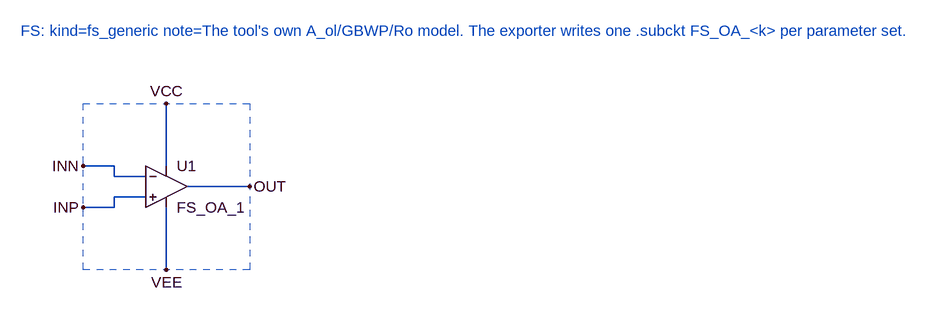
[diagram p0: schematic _FS_generic.asc]
_FS_generic.asc, the LTspice schematic file:
Version 4
SHEET 1 560 560
WIRE 224 240 176 240
WIRE 176 240 176 224
WIRE 176 224 128 224
WIRE 224 272 176 272
WIRE 176 272 176 288
WIRE 176 288 128 288
WIRE 288 256 384 256
WIRE 256 224 256 128
WIRE 256 288 256 384
FLAG 128 224 INN
FLAG 128 288 INP
FLAG 384 256 OUT
FLAG 256 128 VCC
FLAG 256 384 VEE
SYMBOL Opamps\\opamp2 256 192 R0
SYMATTR InstName U1
SYMATTR Value FS_OA_1
TEXT 32 16 Left 2 ;FS: kind=fs_generic note=The tool's own A_ol/GBWP/Ro model. The exporter writes one .subckt FS_OA_<k> per parameter set.
RECTANGLE Normal 128 128 384 384 2

The netlist it stands for:
* _FS_generic.asc
XU1 INP INN VCC VEE OUT FS_OA_1  ; pins In+ In- V+ V- OUT
* FS: kind=fs_generic note=The tool's own A_ol/GBWP/Ro model. The exporter writes one .subckt FS_OA_<k> per parameter set.
.backanno
.end